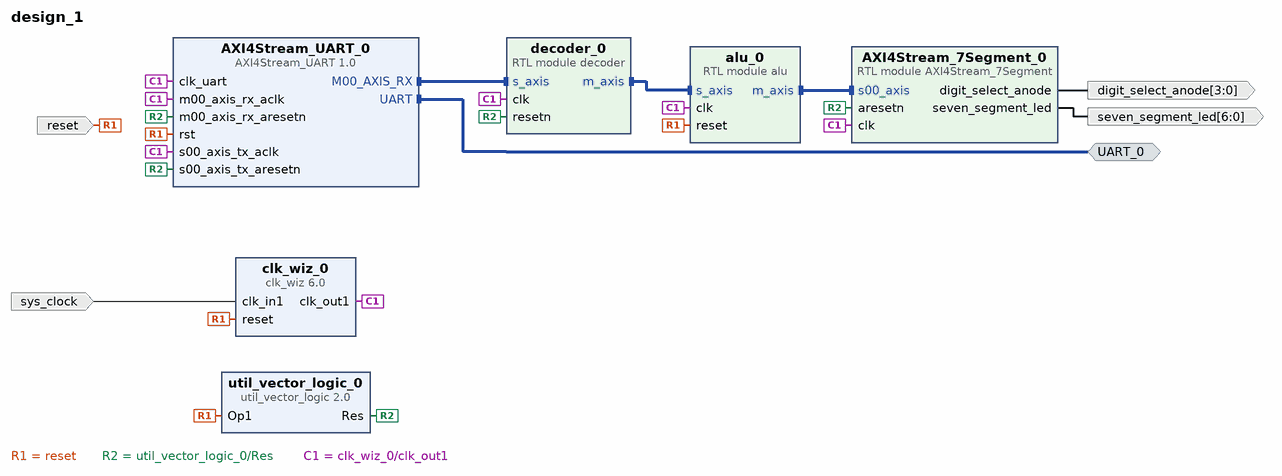
[diagram p0: block diagram of the top level]
# Vivado block design design_1, xc7a35tcpg236-1, Vivado 2019.2
create_bd_design design_1

create_bd_intf_port -mode Master -vlnv xilinx.com:interface:uart_rtl:1.0 UART_0
create_bd_port -dir I -type clk sys_clock
set_property -dict {CONFIG.FREQ_HZ 100000000 CONFIG.PHASE 0.000} [get_bd_ports sys_clock]
create_bd_port -dir I -type rst reset
set_property -dict {CONFIG.POLARITY ACTIVE_HIGH} [get_bd_ports reset]
create_bd_port -dir O -from 3 -to 0 digit_select_anode
create_bd_port -dir O -from 6 -to 0 seven_segment_led

create_bd_cell -type ip -vlnv TimeEngineers:ip:AXI4Stream_UART:1.0 AXI4Stream_UART_0
set_property -dict {CONFIG.UART_BOARD_INTERFACE usb_uart CONFIG.USE_BOARD_FLOW true} [get_bd_cells AXI4Stream_UART_0]
create_bd_cell -type module -reference AXI4Stream_7Segment AXI4Stream_7Segment_0
create_bd_cell -type ip -vlnv xilinx.com:ip:clk_wiz:6.0 clk_wiz_0
set_property -dict {CONFIG.CLK_IN1_BOARD_INTERFACE sys_clock CONFIG.USE_BOARD_FLOW true} [get_bd_cells clk_wiz_0]
create_bd_cell -type ip -vlnv xilinx.com:ip:util_vector_logic:2.0 util_vector_logic_0
set_property -dict {CONFIG.C_OPERATION not CONFIG.C_SIZE 1} [get_bd_cells util_vector_logic_0]
create_bd_cell -type module -reference alu alu_0
create_bd_cell -type module -reference decoder decoder_0

# ---- connections ----

connect_bd_intf_net [get_bd_intf_ports UART_0] [get_bd_intf_pins AXI4Stream_UART_0/UART]
connect_bd_intf_net [get_bd_intf_pins alu_0/m_axis] [get_bd_intf_pins AXI4Stream_7Segment_0/s00_axis]
connect_bd_intf_net [get_bd_intf_pins AXI4Stream_UART_0/M00_AXIS_RX] [get_bd_intf_pins decoder_0/s_axis]
connect_bd_intf_net [get_bd_intf_pins decoder_0/m_axis] [get_bd_intf_pins alu_0/s_axis]
connect_bd_net [get_bd_ports sys_clock] [get_bd_pins clk_wiz_0/clk_in1]
connect_bd_net -net reset_0_1 [get_bd_ports reset] \
  [get_bd_pins clk_wiz_0/reset] [get_bd_pins util_vector_logic_0/Op1] [get_bd_pins AXI4Stream_UART_0/rst] \
  [get_bd_pins alu_0/reset]
connect_bd_net [get_bd_pins AXI4Stream_7Segment_0/digit_select_anode] [get_bd_ports digit_select_anode]
connect_bd_net [get_bd_pins AXI4Stream_7Segment_0/seven_segment_led] [get_bd_ports seven_segment_led]
connect_bd_net [get_bd_pins util_vector_logic_0/Res] \
  [get_bd_pins AXI4Stream_7Segment_0/aresetn] [get_bd_pins AXI4Stream_UART_0/s00_axis_tx_aresetn] \
  [get_bd_pins AXI4Stream_UART_0/m00_axis_rx_aresetn] [get_bd_pins decoder_0/resetn]
connect_bd_net [get_bd_pins clk_wiz_0/clk_out1] \
  [get_bd_pins AXI4Stream_7Segment_0/clk] [get_bd_pins AXI4Stream_UART_0/s00_axis_tx_aclk] \
  [get_bd_pins AXI4Stream_UART_0/m00_axis_rx_aclk] [get_bd_pins AXI4Stream_UART_0/clk_uart] [get_bd_pins alu_0/clk] \
  [get_bd_pins decoder_0/clk]

validate_bd_design
save_bd_design
